# Altium schematic sheet Main.SchDoc
size Tabloid; SheetNumber: 1; SheetTotal: 5
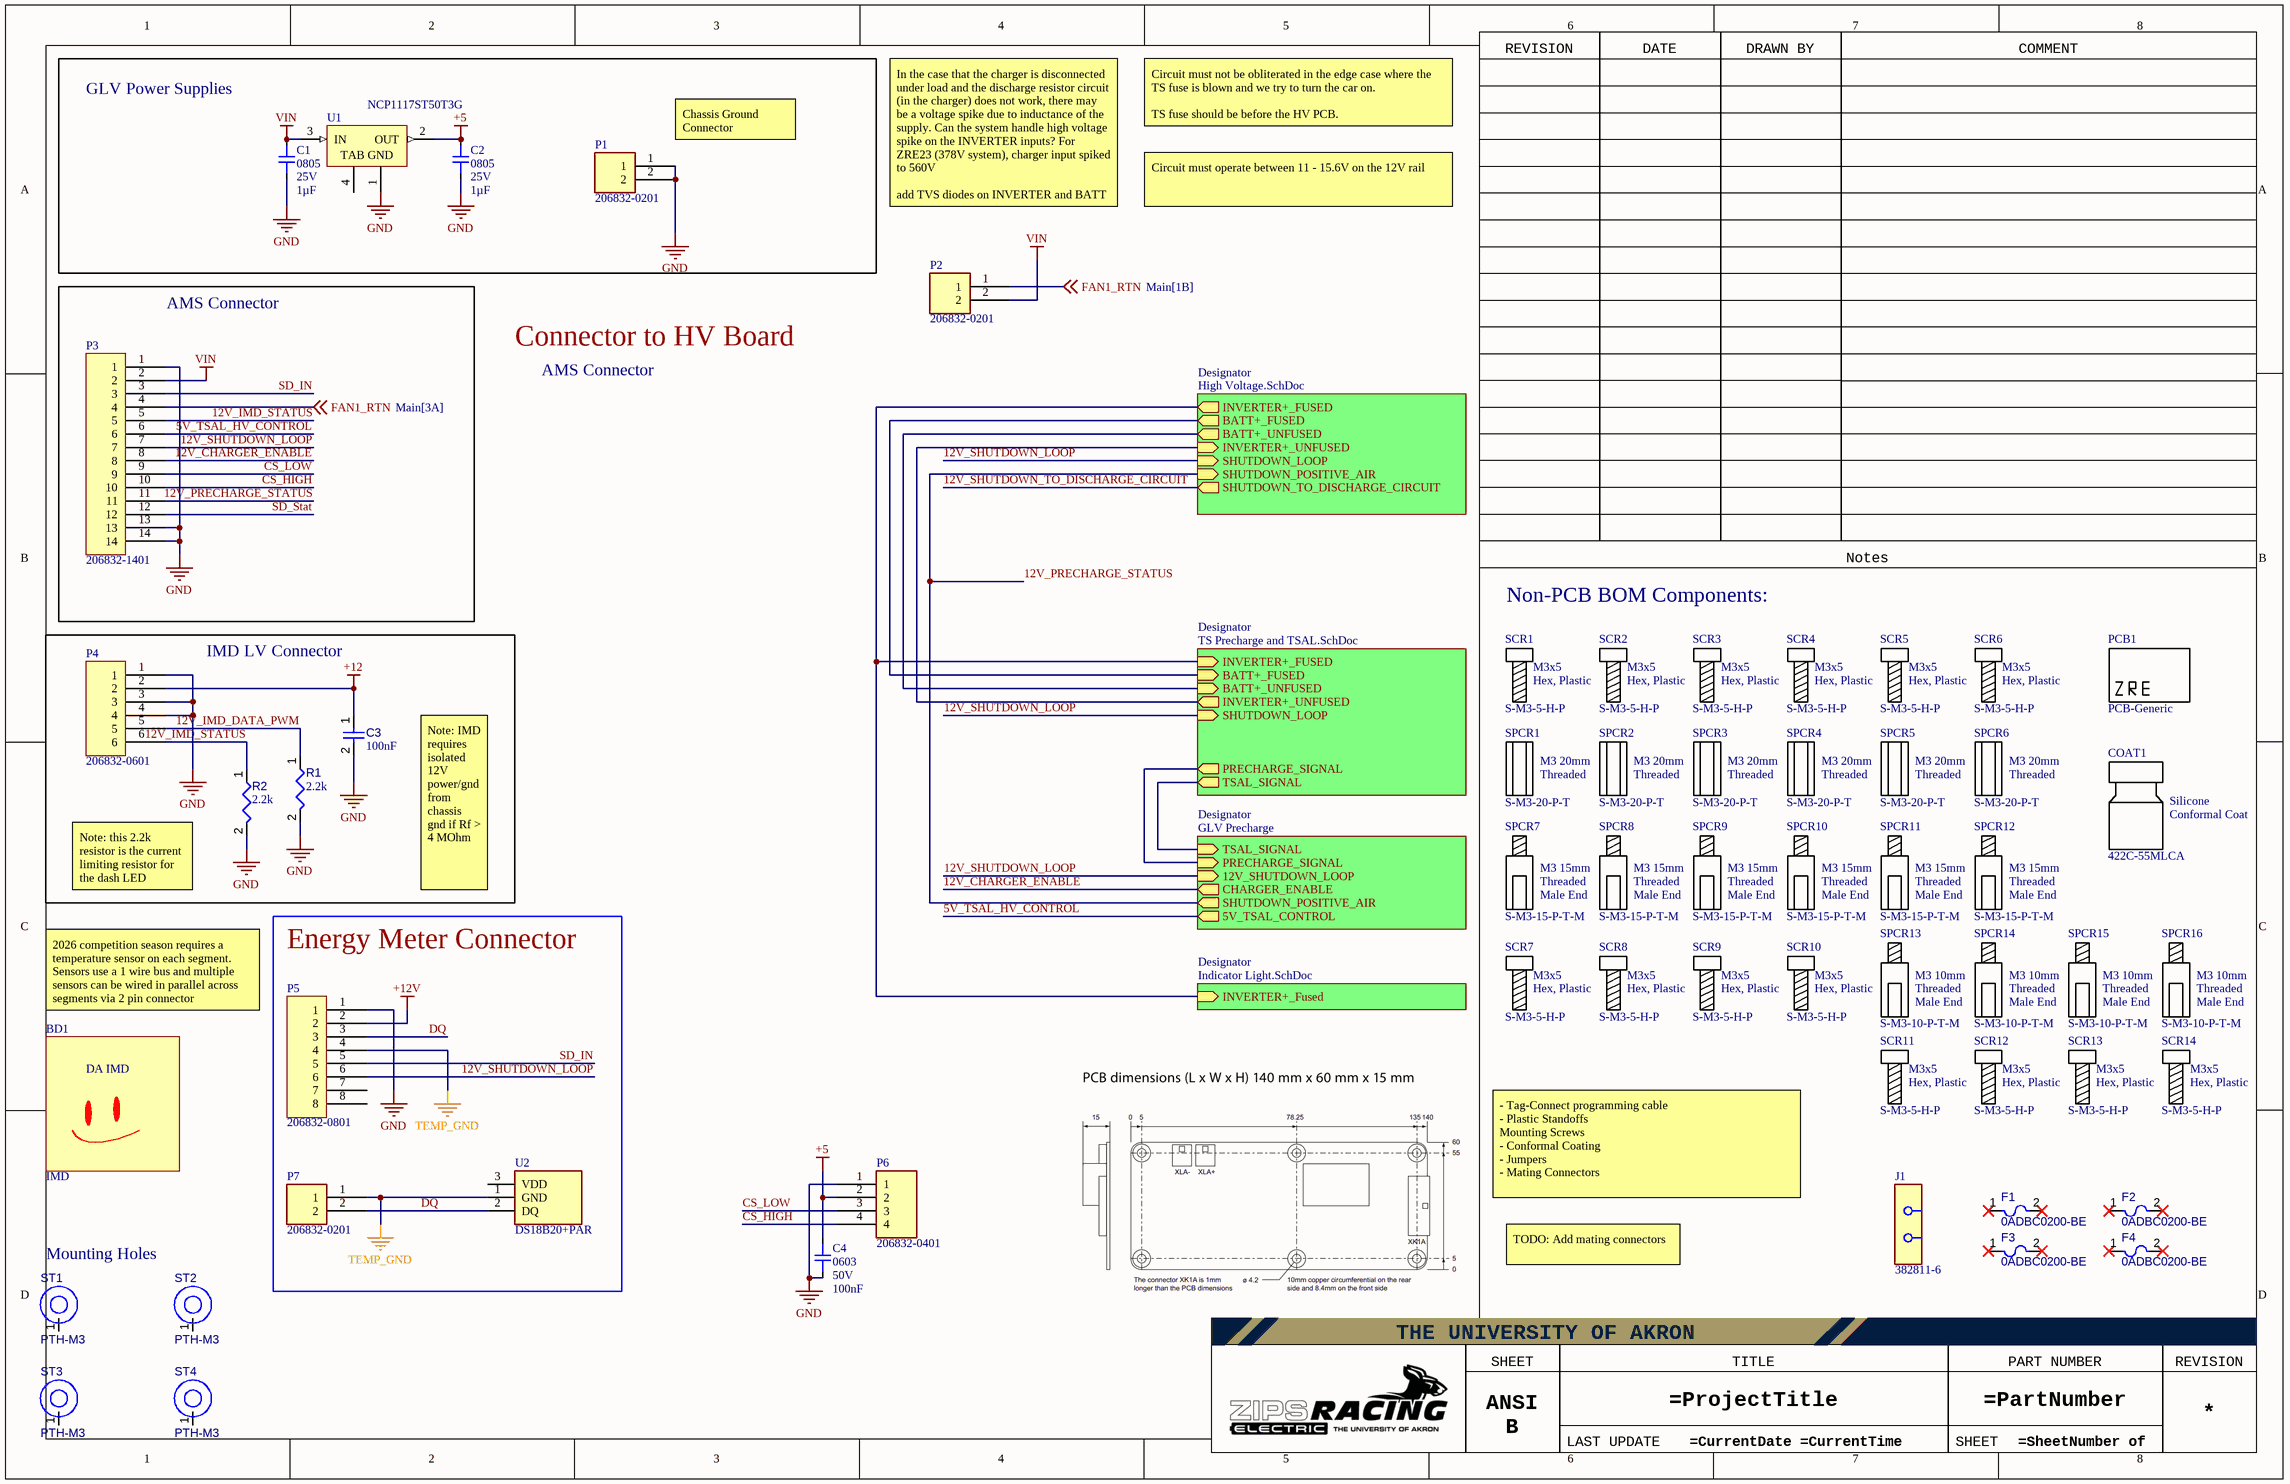
[diagram p0: Main.SchDoc]

## Parts
BD1  IMD  [IMD-Footprint-1]
C1  value 1µF  Footprint: 0805  Voltage: 25V  [CAP-0805]  (hidden comment: Capacitor 1uF 0805 25V)
C2  value 1µF  Footprint: 0805  Voltage: 25V  [CAP-0805]  (hidden comment: Capacitor 1uF 0805 25V)
C3  value 100nF  [CAPC1608X90X40NL10T20]  (hidden comment: Capacitor 100 nF +/-10% 50 V 0603)
C4  value 100nF  Footprint: 0603  Voltage: 50V  [CAP-0603-Generic]  (hidden comment: Capacitor 100nF 0603 5%)
COAT1  422C-55MLCA  (mechanical)
F1  0ADBC0200-BE  (mechanical)
F2  0ADBC0200-BE  (mechanical)
F3  0ADBC0200-BE  (mechanical)
F4  0ADBC0200-BE  (mechanical)
J1  382811-6  [FP-382811-6-MFG]  (mechanical)
P1  206832-0201  [FP-206832-0201-MFG]
P2  206832-0201  [FP-206832-0201-MFG]
P3  206832-1401  [206832-1001-Footprint-1]
P4  206832-0601  [FP-206832-0601-MFG]
P5  206832-0801  [Copy of 206832-1001-Footprint-1]
P6  206832-0401  [MOLEX_2068320401]
P7  206832-0201  [FP-206832-0201-MFG]
PCB1  PCB-Generic  (mechanical)
R1  value 2.2k  [RESC1608X55X25LL10T15]  (hidden comment: Resistor 2.2k +/-1% 0603 100mW)
R2  value 2.2k  [RESC1608X55X25LL10T15]  (hidden comment: Resistor 2.2k +/-1% 0603 100mW)
SCR1  S-M3-5-H-P  (mechanical)
SCR2  S-M3-5-H-P  (mechanical)
SCR3  S-M3-5-H-P  (mechanical)
SCR4  S-M3-5-H-P  (mechanical)
SCR5  S-M3-5-H-P  (mechanical)
SCR6  S-M3-5-H-P  (mechanical)
SCR7  S-M3-5-H-P  (mechanical)
SCR8  S-M3-5-H-P  (mechanical)
SCR9  S-M3-5-H-P  (mechanical)
SCR10  S-M3-5-H-P  (mechanical)
SCR11  S-M3-5-H-P  (mechanical)
SCR12  S-M3-5-H-P  (mechanical)
SCR13  S-M3-5-H-P  (mechanical)
SCR14  S-M3-5-H-P  (mechanical)
SPCR1  S-M3-20-P-T  (mechanical)
SPCR2  S-M3-20-P-T  (mechanical)
SPCR3  S-M3-20-P-T  (mechanical)
SPCR4  S-M3-20-P-T  (mechanical)
SPCR5  S-M3-20-P-T  (mechanical)
SPCR6  S-M3-20-P-T  (mechanical)
SPCR7  S-M3-15-P-T-M  (mechanical)
SPCR8  S-M3-15-P-T-M  (mechanical)
SPCR9  S-M3-15-P-T-M  (mechanical)
SPCR10  S-M3-15-P-T-M  (mechanical)
SPCR11  S-M3-15-P-T-M  (mechanical)
SPCR12  S-M3-15-P-T-M  (mechanical)
SPCR13  S-M3-10-P-T-M  (mechanical)
SPCR14  S-M3-10-P-T-M  (mechanical)
SPCR15  S-M3-10-P-T-M  (mechanical)
SPCR16  S-M3-10-P-T-M  (mechanical)
ST1  PTH-M3  [PTH-M2D5X5]  (no BOM)
ST2  PTH-M3  [PTH-M2D5X5]  (no BOM)
ST3  PTH-M3  [PTH-M2D5X5]  (no BOM)
ST4  PTH-M3  [PTH-M2D5X5]  (no BOM)
U1  NCP1117ST50T3G  [ONSC-SOT-223-4-318H-01_A_V]
U2  DS18B20+PAR  [New footprint 1]

## Blocks framed on the sheet
GLV Power Supplies: C1 C2 P1 U1
AMS Connector: P3
IMD LV Connector: C3 P4 R1 R2
Energy Meter Connector: P5 P7 U2

## Sub-sheets
Designator = TS Precharge and TSAL.SchDoc: SHUTDOWN_LOOP (in), BATT+_UNFUSED (in), INVERTER+_UNFUSED (out), INVERTER+_FUSED (in), BATT+_FUSED (in), PRECHARGE_SIGNAL (out), TSAL_SIGNAL (out)
Designator = Indicator Light.SchDoc: INVERTER+_Fused (in)
Designator = High Voltage.SchDoc: SHUTDOWN_LOOP (in), SHUTDOWN_POSITIVE_AIR (in), SHUTDOWN_TO_DISCHARGE_CIRCUIT (out), INVERTER+_FUSED (out), BATT+_FUSED (out), BATT+_UNFUSED (out), INVERTER+_UNFUSED (in)
Designator = GLV Precharge: 5V_TSAL_CONTROL (out), SHUTDOWN_POSITIVE_AIR (out), CHARGER_ENABLE (out), PRECHARGE_SIGNAL (in), TSAL_SIGNAL (in), 12V_SHUTDOWN_LOOP (in)

## Nets
+5: C2.2 C4.2 P6.2 U1.2(OUT)
+12: C3.1 P4.2
+12V: P5.2
GND: C1.1 C2.1 C3.2 C4.1 P1.1 P1.2 P3.1 P3.13 P3.14 P4.1 P4.3 P4.4 P5.1 P6.1 R1.2 R2.2 U1.1(GND)
TEMP_GND: P5.4 P7.1 U2.1(GND)
VIN: C1.2 P2.2 P3.2 U1.3(IN)
5V_TSAL_HV_CONTROL: P3.6 ; sheet Designator/5V_TSAL_CONTROL
12V_CHARGER_ENABLE: P3.8 ; sheet Designator/CHARGER_ENABLE
12V_IMD_DATA_PWM: P4.5 R1.1
12V_IMD_STATUS: P3.5 P4.6 R2.1
12V_PRECHARGE_STATUS: P3.11 ; sheet Designator/SHUTDOWN_POSITIVE_AIR, sheet Designator/SHUTDOWN_POSITIVE_AIR
12V_SHUTDOWN_LOOP: P3.7 P5.6 ; sheet Designator/SHUTDOWN_LOOP, sheet Designator/SHUTDOWN_LOOP, sheet Designator/12V_SHUTDOWN_LOOP
12V_SHUTDOWN_TO_DISCHARGE_CIRCUIT: sheet Designator/SHUTDOWN_TO_DISCHARGE_CIRCUIT
CS_HIGH: P3.10 P6.4
CS_LOW: P3.9 P6.3
DQ: P5.3 P7.2 U2.2(DQ)
FAN1_RTN: P2.1 P3.4 ; off-sheet FAN1_RTN
SD_IN: P3.3 P5.5
SD_Stat: P3.12
(unnamed): sheet Designator/BATT+_UNFUSED, sheet Designator/BATT+_UNFUSED
(unnamed): sheet Designator/INVERTER+_UNFUSED, sheet Designator/INVERTER+_UNFUSED
(unnamed): sheet Designator/INVERTER+_FUSED, sheet Designator/INVERTER+_Fused, sheet Designator/INVERTER+_FUSED
(unnamed): sheet Designator/BATT+_FUSED, sheet Designator/BATT+_FUSED
(unnamed): sheet Designator/PRECHARGE_SIGNAL, sheet Designator/PRECHARGE_SIGNAL
(unnamed): sheet Designator/TSAL_SIGNAL, sheet Designator/TSAL_SIGNAL

Not connected (* = marked no-connect by the designer): F1 1* 2*; F2 1* 2*; F3 1* 2*; F4 1* 2*; P5 7 8; ST1 1(H1); ST2 1(H1); ST3 1(H1); ST4 1(H1); U1 4(TAB); U2 3(VDD)

## Notes on the sheet
- (near P1) Chassis Ground Connector
- Circuit must not be obliterated in the edge case where the TS fuse is blown and we try to turn the car on.
  TS fuse should be before the HV PCB.
- In the case that the charger is disconnected under load and the discharge resistor circuit (in the charger) does not work, there may be a voltage spike due to inductance of the supply. Can the system handle high voltage spike on the INVERTER inputs? For ZRE23 (378V system), charger input spiked to 560V
  add TVS diodes on INVERTER and BATT inputs, after fuses.
- Circuit must operate between 11 - 15.6V on the 12V rail
- Connector to HV Board
- AMS Connector
- Non-PCB BOM Components:
- Note: this 2.2k resistor is the current limiting resistor for the dash LED
- Note: IMD requires isolated 12V power/gnd from chassis gnd if Rf > 4 MOhm
- (near BD1) 2026 competition season requires a temperature sensor on each segment. Sensors use a 1 wire bus and multiple sensors can be wired in parallel across segments via 2 pin connector
- - Tag-Connect programming cable
  - Plastic Standoffs
  Mounting Screws
  - Conformal Coating
  - Jumpers
  - Mating Connectors
- Mounting Holes
- TODO: Add mating connectors
- REVISION
- DATE
- DRAWN BY
- COMMENT
- Notes
- THE UNIVERSITY OF AKRON
- SHEET SIZE
- TITLE
- PART NUMBER
- ANSI B
- LAST UPDATE
- SHEET
- (in symbol CMP-00028-00010-4) M3x5; Hex, Plastic
- (in symbol CMP-00028-00013-1) M3 20mm; Threaded
- (in symbol CMP-00028-00014-2) M3 15mm; Threaded; Male End
- (in symbol CMP-00028-00015-1) M3 10mm; Threaded; Male End
- (in symbol CMP-00030-00004-3) Silicone; Conformal Coat
- (in symbol CMP-00035-4) DA IMD

## Library data of the parts
BD1 = CMP-00035-4: IMD for the CAR
C1 C2 = CMP-00045-1: Capacitor, 0805
C3 = CMP-001-00017-6: Chip Capacitor, 100 nF, +/- 10%, 50 V, 0603 (1608 Metric); Voltage Rating: 50V; Capacitor Type: Ceramic; Tolerance: 10%; Mounting Technology: SM; Max Operating Temperature: 125°C; RoHS Compliant: True; Pins: 2; Case/Package: 0603; Min Operating Temperature: -55°C
C4 = CMP-00030-2: Capacitor, 0603, 5%; Max Operating Temperature: 125°C; Min Operating Temperature: -55°C
COAT1 = CMP-00030-00004-3: Silicone Conformal Coating, MG Chemicals, Clear, UL94 V-0, high Temperature, UV indicator, 55mL, Conform, Coat
F1-F4 = CMP-005-00015-1: Electric Fuse, Fast Blow, 0.2A, 1000VAC, 1000VDC, 0.2A (IR), Inline/holder, 6x32mm; RoHS Compliant: Yes
J1 = CMP-00030-00005-2: 2-Pin Header Pin Jumper, 0.1" pitch, Shunts/Jumper Connector; Body Length: 2.498inch; Contact Pattern: RECTANGULAR; Body Breadth: 0.2inch; Body Depth: 0.25inch; Number of Contacts: 2; Reliability: COMMERCIAL; Number Of Connectors: 1; Dielectric Withstanding Voltage (DC): 1kV; Durability: 25Cycles; Mating Contact Pitch: 0.1inch; Reference Standard: UL; Contact Resistance: 15mR; Connector Type: Interconnection Device; Insulation Resistance: 1GR; Plating Thickness: 15uin; Rated Current (Signal): 3A; Body/Shell Style: PLUG; Contact Style: SQ PIN-SKT; Contact Gender: Female; Contact Finish - Mating: AU ON NI; Insulation Material: Glass; Reach SVHC Compliant: Yes; Insulation Color: Black; Number of Rows Loaded: 1; RoHS Compliant: Yes; Mounting Style: STRAIGHT; Max Operating Temperature: 105°C; Contact Material: Bronze; Min Operating Temperature: -65°C
P1 P2 P7 = CMP-002-00123-3: Molex, Micro-Fit+, 2 Position, Dual-Row, Header, Male, 3mm Pitch; Max Current Rating: 13A; Voltage Rating: 600V
P3 = CMP-002-00137-1: MICRO-FIT Plus Header Assembly Dual Row 10 Position Straight Tin
P4 = CMP-002-00091-5: Molex, Micro-Fit+, 6 Position, Dual-Row, Header, Male, 3mm Pitch; Connector Type: PCB Header; Voltage Rating: 600V; Max Current Rating: 12.5A; Max Operating Temperature: 104°C; Pins: 6; Mounting Technology: Thru-hole; Gender: Male; Min Operating Temperature: -40°C
P5 = CMP-002-00132-2: MICRO-FIT Plus Header Assembly Dual Row 8 Position Straight Tin
P6 = CMP-002-00114-6: Micro-Fit+ Vertical Header, Through Hole, 3.00mm Pitch, Dual Row, 4 Circuits, Tin (Sn) Plating, Glow-Wire Capable, Black, Tray; Voltage Rating: 600V; Max Current Rating: 12.5A; Rows: 2; Mating Cycls: 25; Connector Type: PCB Header; Gender: Male; ComponentLink1Description: Datasheet; ComponentLink1URL: https://www.molex.com/en-us/products/part-detail/2068320401?display=pdf; Max Operating Temperature: 105°C; Plating Material: Tin; Mounting Technology: Thru-hole; Min Operating Temperature: -40°C; Pins: 4
PCB1 = CMP-00028-00012-1: Generic PCB Component for BOM inclusion
R1 R2 = CMP-009-00198-1: Description Chip Resistor, 2.2 KOhm, +/-1%, 0.1 W, -55 to 155 degC, 0603 (1608 Metric); Temperature Coefficient: 100ppm/°C; Rated Temperature: 70°C; Tolerance: 1%; Working Voltage: 75V; Case/Package: 0603; Power: 100mW; Mounting Technology: Surface Mount; Min Operating Temperature: -55°C; Max Operating Temperature: 155°C; RoHS Compliant: Yes; Pins: 2
SCR1-SCR14 = CMP-00028-00010-4: Generic Screw, M3, 5mm length, Hex Head, Plastic; Thread Pitch: 0.8mm; Material: Plastic; Pins: 0; Length: 5mm; Head Type: Hex; Thread Size: M3
SPCR1-SPCR6 = CMP-00028-00013-1: Generic M3 Spacer, 10 mm length, plastic, threaded; Pins: 0
SPCR7-SPCR12 = CMP-00028-00014-2: Generic M3 Spacer, 15 mm length, plastic, threaded, one male end; Pins: 0
SPCR13-SPCR16 = CMP-00028-00015-1: Generic M3 Spacer, 10 mm length, plastic, threaded, one male end; Pins: 0
ST1-ST4 = CMP-00028-00008-5: M3 Plated Thru-Hole  (3.2mm), 7mm pad, 10 mm keep out zone; Pins: 1
U1 = CMP-019-00031-3: Low-Dropout Positive Fixed Voltage Regulator, 1 A, 5 V Vout, 0 to 125 degC, 4-Pin SOT-223, Pb-Free, Tape and Reel; Manufacturer: ON Semiconductor; Current Rating: -600A; Output Voltage: 5V; Max Ouput Current: 1A; Max Input Voltage: 20V; Outputs: 1; Dropout Voltage: 1.2V; Min Input Voltage: 3.5V; Datasheet Version: Rev. 26, 08/2013; Package Quantity: 4000; Package Description: 4-Pin Small Outline Transistor, Body 6.5 x 3.5 mm, Pitch 2.3 mm; RoHS Compliant: True; Max Operating Temperature: 125°C; Nominal Output Voltage: 5V; Datasheet URL: https://datasheet.ciiva.com/28483/1748260-28483320.pdf; Min Operating Temperature: 0°C; Manufacturer URL: http://www.onsemi.com/; Output Current: 1A; Pins: 3; Mounting Technology: SM; Package Reference: SOT-223-4-318H-01_A; Case/Package: TO-261-4; Packaging: TapeandReel
U2 = CMP-015-00013-3: Serial Switch/Digital Sensor, 12 Bit(s), 0.50Cel, Rectangular, 3 Pin, Through Hole Mount